# Altium schematic sheet Connector_Exp.SchDoc: Connectors
size A3; Organization: PRISUM; Revision: 2; SheetNumber: 2; SheetTotal: 6
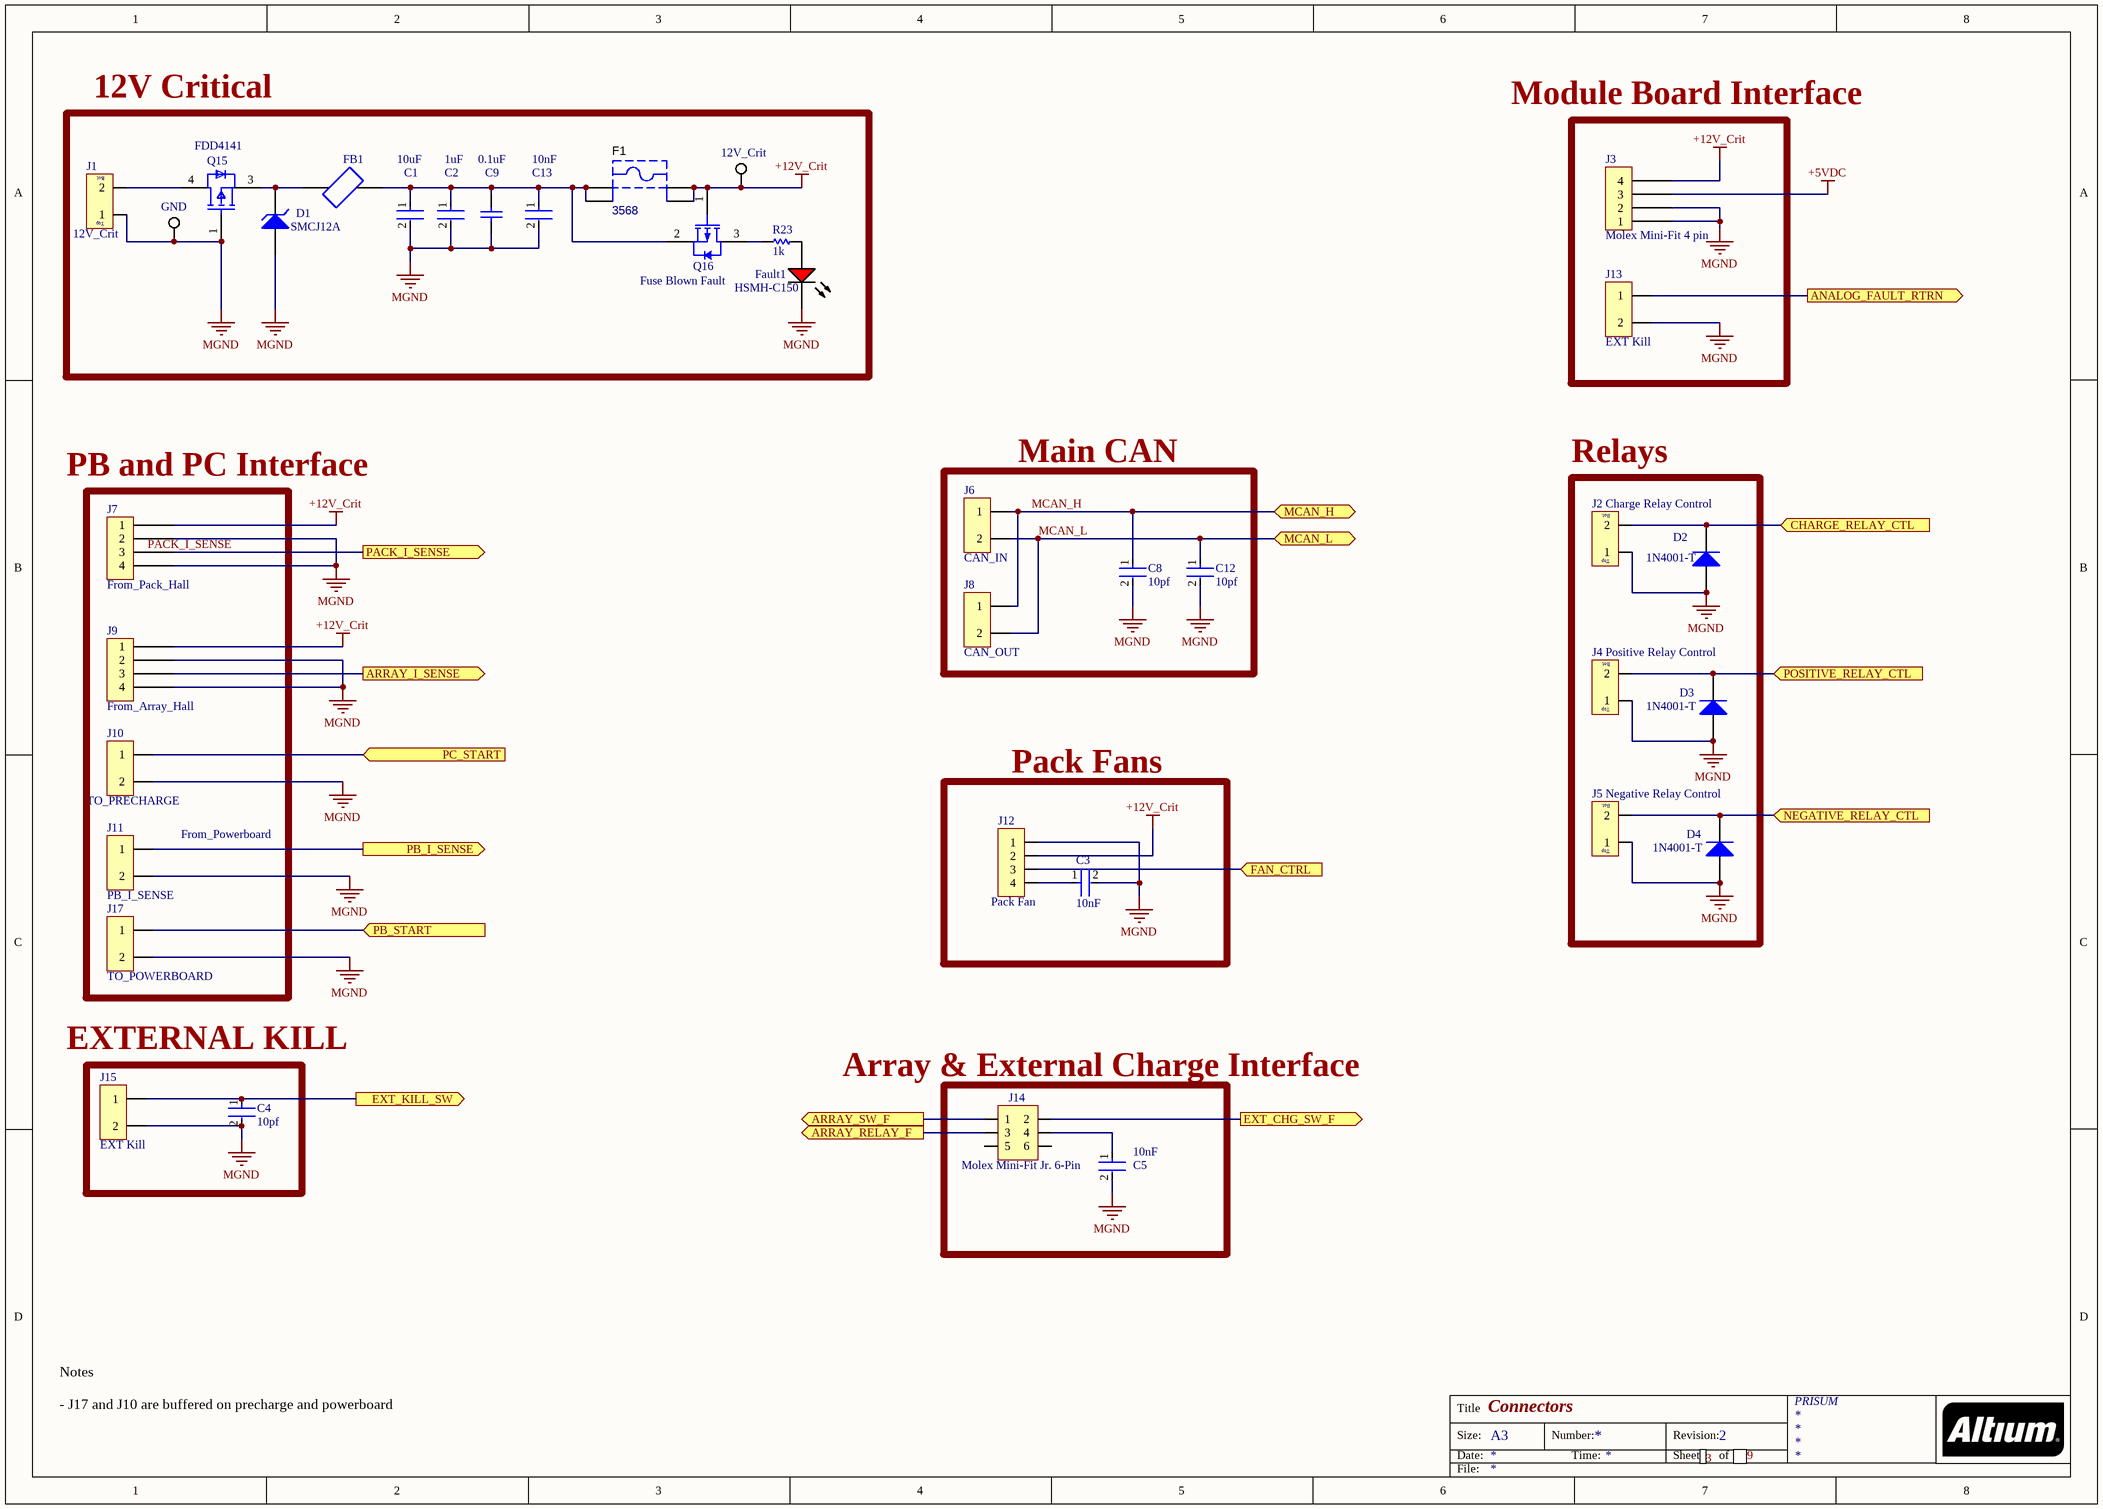
[diagram p0: Connector_Exp.SchDoc]

## Parts
12V_Crit  Test Point  [Test Point]  (value not drawn)
C1  Capacitance: 10uF  [FP-CL31-IPC_A]  (hidden comment: CL31A106MOHNNNE)
C2  Capacitance: 1uF  [FP-CL31-IPC_A]  (hidden comment: CL31F105ZOCNNNC)
C3  Capacitance: 10nF  [FP-CGA3E-0_3-0_1-IPC_A]  (hidden comment: CGA3E2X8R2A103K080AD)
C4  10pf  [FP-C0805C-DN-MFG]
C5  Capacitance: 10nF  [FP-CGA3E-0_3-0_1-IPC_A]  (hidden comment: CGA3E2X8R2A103K080AD)
C8  10pf  [FP-C0805C-DN-MFG]
C9  Capacitance: 0.1uF  [CAPC2013X94X50LL20T25]  (hidden comment: 08055C104JAT2A)
C12  10pf  [FP-C0805C-DN-MFG]
C13  Capacitance: 10nF  [FP-CGA3E-0_3-0_1-IPC_A]  (hidden comment: CGA3E2X8R2A103K080AD)
D1  SMCJ12A  [LFUS-DO-214AB-2_V]
D2  1N4001-T  [DIOD-DO-41-P-2_V]
D3  1N4001-T  [DIOD-DO-41-P-2_V]
D4  1N4001-T  [DIOD-DO-41-P-2_V]
F1  3568  [KSTN-3568_V]
Fault1  HSMH-C150  [AVAG-HSMX-C150_V]
FB1  HI1206N800R-10  [FB_HI1206N800R-10]  (value not drawn)
GND  Test Point  [Test Point]  (value not drawn)
J1  12V_Crit  [CONN_2P_MEGAFIT_HORIZONTAL]
J2  Charge Relay Control  [CONN_2P_MEGAFIT_HORIZONTAL]
J3  Molex Mini-Fit 4 pin  [Molex Mini-Fit Jr. 4-Pin - no flange]
J4  Positive Relay Control  [CONN_2P_MEGAFIT_HORIZONTAL]
J5  Negative Relay Control  [CONN_2P_MEGAFIT_HORIZONTAL]
J6  CAN_IN  [Mini-Fit Jr. 2]
J7  From_Pack_Hall  [Molex Mini-Fit Jr. 4-Pin - no flange]
J8  CAN_OUT  [Mini-Fit Jr. 2]
J9  From_Array_Hall  [Molex Mini-Fit Jr. 4-Pin - no flange]
J10  TO_PRECHARGE  [Mini-Fit Jr. 2]
J11  PB_I_SENSE  [Mini-Fit Jr. 2]
J12  Molex Mini-Fit Jr. 4-Pin no flange  [Molex Mini-Fit Jr. 4-Pin - no flange]  (value not drawn)
J13  EXT Kill  [Mini-Fit Jr. 2]
J14  Molex Mini-Fit Jr. 6-Pin  [Molex Mini-Fit Jr. 6-Pin]
J15  EXT Kill  [Mini-Fit Jr. 2]
J17  TO_POWERBOARD  [Mini-Fit Jr. 2]
Q15  FDD4141  [FP-369AS-MFG]
Q16  Fuse Blown Fault  [INTR-SOT-23-3_V]
R23  SchematicInformation: 1k  [R_0603]  (hidden comment: RES_1k_1%_0603)

## Blocks framed on the sheet
12V Critical: 12V_Crit C1 C2 C9 C13 D1 F1 Fault1 FB1 GND J1 Q15 Q16 R23
From_Powerboard: J7 J9-J11 J17
Main CAN: C8 C12 J6 J8
Relays: D2-D4 J2 J4 J5
Pack Fans: C3 J12

## Ports
ANALOG_FAULT_RTRN (out), ARRAY_I_SENSE (out), ARRAY_RELAY_F (out), ARRAY_SW_F (out), CHARGE_RELAY_CTL (in), EXT_CHG_SW_F (out), EXT_KILL_SW (out), FAN_CTRL (in), MCAN_H (bidir), MCAN_L (bidir), NEGATIVE_RELAY_CTL (in), PACK_I_SENSE (out), PB_I_SENSE (out), PB_START (in), PC_START (in), POSITIVE_RELAY_CTL (in)

## Nets
+5VDC: J3.3
+12V_Crit: 12V_Crit.1 F1.3 F1.4 J3.4 J7.1 J9.1 J12.2 Q16.1(GATE)
MGND: C1.2 C2.2 C3.2 C4.2 C5.2 C8.2 C9.1 C12.2 C13.2 D1.1(A) D2.1(A) D3.1(A) D4.1(A) Fault1.2(K) GND.1 J1.1 J2.1 J3.1 J3.2 J4.1 J5.1 J7.2 J7.4 J9.2 J9.4 J10.2 J11.2 J12.1 J13.2 J15.2 J17.2 Q15.1(G)
ANALOG_FAULT_RTRN: J13.1 ; port ANALOG_FAULT_RTRN
ARRAY_I_SENSE: J9.3 ; port ARRAY_I_SENSE
ARRAY_RELAY_F: J14.3 ; port ARRAY_RELAY_F
ARRAY_SW_F: J14.1 ; port ARRAY_SW_F
CHARGE_RELAY_CTL: D2.2(K) J2.2 ; port CHARGE_RELAY_CTL
EXT_CHG_SW_F: J14.2 ; port EXT_CHG_SW_F
EXT_KILL_SW: C4.1 J15.1 ; port EXT_KILL_SW
FAN_CTRL: J12.3 ; port FAN_CTRL
MCAN_H: C8.1 J6.1 J8.1 ; port MCAN_H
MCAN_L: C12.1 J6.2 J8.2 ; port MCAN_L
NEGATIVE_RELAY_CTL: D4.2(K) J5.2 ; port NEGATIVE_RELAY_CTL
PACK_I_SENSE: J7.3 ; port PACK_I_SENSE
PB_I_SENSE: J11.1 ; port PB_I_SENSE
PB_START: J17.1 ; port PB_START
PC_START: J10.1 ; port PC_START
POSITIVE_RELAY_CTL: D3.2(K) J4.2 ; port POSITIVE_RELAY_CTL
NetC1_1: C1.1 C2.1 C9.2 C13.1 F1.1 F1.2 FB1.2 Q16.2(SOURCE)
NetC3_1: C3.1 J12.4
NetC5_1: C5.1 J14.4
NetD1_2: D1.2(K) FB1.1 Q15.3(S)
NetFault1_1: Fault1.1(A) R23.2
NetJ1_2: J1.2 Q15.4(D)
NetQ16_3: Q16.3(DRAIN) R23.1

Not connected (* = marked no-connect by the designer): J14 5 6

## Notes on the sheet
- Module Board Interface
- (near J7) PB and PC Interface
- (near J12) Pack Fan
- EXTERNAL KILL
- (near J14) Array & External Charge Interface
- Notes
  - J17 and J10 are buffered on precharge and powerboard
- 3
- 9
- Labels drawn without touching a wire or pin: PACK_I_SENSE
- Title
- Size:
- Date:
- A3
- Number:
- Time:
- Revision:
- Sheet
- of
- File:
- (in symbol CONN_2P_MEGAFIT_HORIZONTAL) Bot.; Top

## Library data of the parts
C1 = CMP-13271-002453-1: Cap Ceramic 10uF 16V X5R ±20% SMD 1206 +85°C Embossed T/R; Thickness: 0.071inch; Case Code (Imperial): 1206; Case Code (Metric): 3216; Height: 1.6mm; Max Operating Temperature: 85°C; Voltage Rating: 16V; Package Quantity: 1; Length: 3.2mm; Dielectric: X5R; Voltage Rating (DC): 16V; Tolerance: 20%; Case/Package: 1206; Depth: 1.6mm; Mount: Surface Mount; Radiation Hardening: No; Width: 0.063inch; Lead Free: Lead Free; Min Operating Temperature: -55°C; Packaging: Tape and Reel
C2 = CMP-13271-003959-1: Cap Ceramic 1uF 16V Y5V -20/+80% SMD 1206 +85°C Embossed T/R; Tolerance: 80%; Length: 3.2mm; Package Quantity: 4000; Lead Free: Lead Free; Height: 0.85mm; Packaging: Tape and Reel; Max Operating Temperature: 85°C; Case Code (Imperial): 1206; Case/Package: 1206; Dielectric: Y5V; Min Operating Temperature: -30°C; Voltage Rating (DC): 16V; Width: 0.063inch; Mount: Surface Mount; Voltage Rating: 16V; Depth: 1.6mm; Thickness: 0.039inch; Radiation Hardening: No; Case Code (Metric): 3216
C3 C5 C13 = CMP-08246-000769-1: Cap Ceramic 10nF 100V X8R 10% Pad SMD 0603 +150°C Automotive T/R; Mount: Surface Mount; Voltage Rating (DC): 100V; Termination: SMD/SMT; Dielectric: X8R; Case/Package: 0603; Ratings: AEC-Q200; Voltage Rating: 100V; Packaging: Tape and Reel; Thickness: 0.035inch; Composition: Ceramic; Max Operating Temperature: 150°C; Width: 0.031inch; Height: 0.8mm; Weight: 7.1E-05oz; Depth: 0.8mm; Min Operating Temperature: -55°C; Length: 1.6mm; Case Code (Metric): 1608; Tolerance: 10%; Package Quantity: 4000; Case Code (Imperial): 0603
C4 C8 C12 = CMP-03020-001866-1: C0805 10 pF C0G 30ppm/°C 2.00% 50 V; Manufacturer Part Number: C0805C100G5GACTU; Manufacturer: KEMET; Tolerance: 0.02; Voltage Rating: 50 V; Material: Ceramic; Device Class L1: Passive Components; Category: Cap; Temperature: -55°C to +125°C; Height: 0.88mm; Ipc Land Pattern Name: CAPC200125X78; ComponentLink2URL: https://content.kemet.com/datasheets/KEM_C1003_C0G_SMD.pdf; Capacitance: 10 pF; Octopart: https://octopart.com/c0805c100g5gactu-kemet-20071675; Device Class L2: Capacitors; Device Class L3: Ceramic Capacitors; Temperature Range Low: -55°C; RoHS: TRUE; Temperature Range High: +125°C; Temperature Characteristic: C0G; Value: 10 pF; Mouser Description: Multilayer Ceramic Capacitors MLCC - SMD/SMT 50volts 10pF C0G 2%; ComponentLink2Description: Datasheet; Package: C0805C-DN; Lead Free: Yes; Automotive: No; Temperature Coefficient: 30ppm/°C
C9 = CMP-2000-05808-1: Chip Capacitor, 0.1 uF, +/- 5%, 50 V, -55 to 125 degC, 0805 (2012 Metric), RoHS, Tape and Reel; Case Width: 1.25mm; Case Length: 2.01mm; Case Height: 0.94mm; Brand: AVX; Type: StandardX7RMLCCs; Capacitance - nF: 100nF; Dissipation Factor DF: 2.5; Voltage Rating DC: 50V; Temperature Coefficient / Code: +/-15%; Capacitance - pF: 100000pF; Dielectric: X7R; Dimensions: 1.25mmWx2.01mmLx0.94mmH; Product: GeneralTypeMLCCs; Package Description: 2-Pin Surface Mount Device, Body 2.01 x 1.25 mm; Package / Case: 0805(2012metric); Product Category: MultilayerCeramicCapacitorsMLCC-SMD/SMT; Case Code - mm: 2012; Packaging: Reel; Manufacturer URL: http://www.avx.com/; Operating Temperature Range: -55Cto+125C; Termination Style: SMD/SMT; Maximum Operating Temperature: +125C; Case Code - in: 0805; Minimum Operating Temperature: -55C; Factory Pack Quantity: 4000; RoHS: Details; Voltage Rating: 50V; Tolerance: 5%; Package Reference: 0805; Datasheet URL: http://www.farnell.com/datasheets/1679506.pdf; Manufacturer: AVX; Mounting Technology: SurfaceMount; Datasheet Version: 11/2012
D1 = CMP-2000-07101-1: Transient Voltage Suppression Diode, 12 V, -65 to 150 degC, 2-Pin DO-214AB (SMCJ), RoHS, Tape and Reel; Manufacturer: Littelfuse; Directional: Uni-Directional; Breakdown Voltage-Max: 14.7V; Clamping Voltage-Max: 19.9V; Breakdown Voltage-Min: 13.3V; Power Dissipation: 1500W; Manufacturer URL: http://www.littelfuse.com/; Datasheet Version: 11/2015; Package Description: 2-Pin Surface Mount Device, Body 6.855 x 5.905 mm; Package Reference: DO-214AB; Mounting Technology: SurfaceMount; Datasheet URL: http://www.littelfuse.com/products/tvs-diodes/surface-mount/~/media/electronics/datasheets/tvs_diodes/littelfuse_tvs_diode_smcj_datasheet.pdf.pdf; ComponentLink1Description: Datasheet; ComponentLink1URL: https://www.littelfuse.com/products/tvs-diodes/surface-mount/~/media/electronics/datasheets/tvs_diodes/littelfuse_tvs_diode_smcj_datasheet.pdf.pdf; ComponentLink2Description: Digikey; ComponentLink2URL: https://www.digikey.com/product-detail/en/SMCJ12A/SMCJ12ALFCT-ND/762588?utm_campaign=buynow&WT.z_cid=ref_octopart_dkc_buynow&utm_medium=aggregator&curr=usd&site=us&utm_source=octopart
D2-D4 = CMP-0639-00006-2: 1.0 A Rectifier, 15 pF, 50 V, -65 to 150 degC, 2-Pin DO-41 Plastic, RoHS, Tape and Reel; Manufacturer: Diodes Inc; VF (V): 1; CT (pF): 15; Max. IR (uA): 5; VRRM (V): 50; Max. IFSM (A): 30; RoHS: TRUE; Mounting Technology: Through Hole; PartNumber: 1N4001-T; ComponentLink2Description: Datasheet; DatasheetVersion: Rev. 8-2; Operating Temperature Range (degC): -65 to 150; Packing: Tape and Reel; PackageReference: DO-41-P-2; ComponentLink1URL: http://diodes.com/; PackageDescription: 2-Pin Axial Lead, Body 4.635 x 2.36 mm, Lead Spread 25.4 mm; ComponentLink2URL: http://diodes.com/datasheets/ds28002.pdf; Max. Average Rectified Current IO (A): 1; ComponentLink1Description: Manufacturer URL
F1 = CMP-2000-05464-1: Fuse Holder, 20 A, 500 V, -50 to 145 degC, 4-Pin THD, RoHS; Manufacturer: Keystone; Package Reference: 3568; Datasheet Version: 04/2013; Datasheet URL: https://datasheet.ciiva.com/16294/m60-2p40-16294706.pdf; Manufacturer URL: http://www.keyelco.com/; Mounting Technology: ThroughHole; Package Description: 4-Pin Through Hole Device, Body 16 x 6.73 mm, Pitch 9.9 mm
Fault1 = CMP-2000-06426-1: LED Uni-Color Red, 65 mW, 25 mA, -40 to 85 degC, 2-Pin SMD, RoHS, Tape and Reel; Manufacturer: Avago; Product Height (mm): 1.1mm; Power Dissipation: 78W; Product Length (mm): 3.2mm; Forward Voltage: 2.6V; Luminous Intensity: 17mcd; DELETED: Compliant; Shape Type: Rectangular; Peak Wavelength: 660nm; Main Category: ChipLED; Dominant Wave Length: 639nm; Rad Hardened: No; Lens Type: ColorlessDiffused; Product Depth (mm): 1.6mm; Reverse Voltage: 5V; Forward Current: 25mA; Chip Material: GaAlAs; Test Current (It): 20mA; Viewing Angle: 170deg; Number of  Elements: 1; Type: Uni-Color; Package Reference: HSMX-C150; Package Description: 2-Pin Surface Mount Device, Body 3.2 x 1.6 mm; Operating Temp Range: -40Cto85C; Mounting: SurfaceMount; Emitting Color: Red; Pin Count: 2; Operating Temperature Classification: Industrial; Datasheet URL: http://media.digikey.com/pdf/Data%20Sheets/Avago%20PDFs/HSMz-Czzz.pdf; Package Type: ChipLed; Mounting Technology: SurfaceMount; High Brightness: No; Lens Dimensions: 2x1.6x0.6mm; Manufacturer URL: http://www.avagotech.com/; Lum Intensity: 17mcd; Datasheet Version: 03/2012; Packaging: TapeandReel
FB1 = HI1206N800R-10: 80 Ohms @ 100MHz 1 Power, Signal Line Ferrite Bead 1206 (3216 Metric) 3A 35mOhm; MF: Laird-Signal Integrity; SnapEDA_Link: https://www.snapeda.com/parts/HI1206N800R-10/Laird-Signal%20Integrity%20Products/view-part/296889/?ref=snap; Purchase-URL: https://pricing.snapeda.com/search/part/HI1206N800R-10/?ref=eda; Check_prices: https://www.snapeda.com/parts/HI1206N800R-10/Laird-Signal%20Integrity%20Products/view-part/296889/?ref=eda; Value: *; Digi-Key_Part_Number: 240-2409-1-ND; Package: 1206 Laird-Signal Integrity; MP: HI1206N800R-10
J1 J2 J4 J5 = CONN_2P_MEGAFIT_HORIZONTAL: *; Manufacturer Part Number: 0768250002; Manufacturer: Molex; SchematicInformation: MegaFit_2P; DigiKey Part Number: WM11969-ND
J6 J8 J10 J11 J13 J15 J17 = Mini-Fit Jr. 2-pin: Mini-Fit Jr. 2-pin Right Angle; Manufacturer: Molex Inc; Manufacturer Part Number: 0039300020; Connector Type: Header, Shrouded; Number of Positions: 2; Number of Positions Loaded: All; Row Spacing: 0.165" (4.20mm); Ordering: http://search.digikey.com/scripts/DkSearch/dksus.dll?Detail&name=WM1351-ND; Datasheet: http://www.molex.com/pdm_docs/sd/039301020_sd.pdf; Supplier 1: Digi-Key; RoHS: RoHS Compliant; Category: Connectors, Interconnects; Stock 1: 371; Pricing 1: 1=0.77, 10=0.674, 50=0.6078, 100=0.5815, 250=0.5286, 500=0.47574, 1000=0.42288, 2500=0.38324, 5000=0.37002 (USD); Contact Type: Male Pin; Pitch: -; Number of Rows: 2; Contact Mating Length: -; Mounting Type: Through Hole, Right Angle; Termination: Solder; Fastening Type: Locking Ramp; Features: Board Lock; Contact Finish: Tin; Contact Finish Thickness: 200µin (5.08µm); Color: Natural; Packaging: Tray; ComponentLink1URL: http://www.molex.com/pdm_docs/sd/039300020_sd.pdf; ComponentLink1Description: http://www.molex.com/pdm_docs/sd/039300020_sd.pdf
  J6 J8 J11 J13 J15 J17: Supplier Part Number 1: WM21351-ND
J7 J9 = Molex Mini-Fit 4 pin
J12 = Molex Mini-Fit Jr. 4-Pin: 4-Pin Molex Mini-Fit Jr. Header; Manufacturer Part Number: 0039301040; Connector Type: Header, Shrouded; Number of Positions: 4; Number of Positions Loaded: All; Pitch: 0.165" (4.20mm); Drawn By: Aaron Mills; Drawing Date: Jan. 2, 2011; Manufacturer: Molex; ComponentLink1URL: http://www.molex.com/pdm_docs/sd/039295043_sd.pdf; ComponentLink1Description: Datasheet; Supplier1: http://search.digikey.com/us/en/products/39-30-1040/WM1352-ND/561079; Supplier 1: Digi-Key; RoHS: RoHS Compliant; Category: Connectors, Interconnects; Stock 1: 4191; Pricing 1: 1=0.77, 10=0.674, 25=0.6344, 50=0.6078, 100=0.5815, 250=0.5286, 500=0.47574, 1000=0.42288, 2500=0.38324 (USD); Contact Type: Male Pin; Number of Rows: 2; Row Spacing: 0.165" (4.20mm); Contact Mating Length: -; Mounting Type: Through Hole, Right Angle; Termination: Solder; Fastening Type: Locking Ramp; Features: Board Lock; Contact Finish: Tin; Contact Finish Thickness: 100µin (2.54µm); Color: Natural; Packaging: Tray; ComponentLink2URL: http://www.molex.com/pdm_docs/sd/039301040_sd.pdf; ComponentLink2Description: http://www.molex.com/pdm_docs/sd/039301040_sd.pdf; Supplier Part Number 1: WM1352-ND
J14 = Molex Mini-Fit Jr. 6-Pin: 6-Pin Molex Mini-Fit Jr. Header  through hole; Drawn By: Aaron Mills; Drawing Date: Jan. 2, 2011; Manufacturer: Molex; ComponentLink1URL: http://www.molex.com/pdm_docs/sd/039295063_sd.pdf; ComponentLink1Description: Datasheet; ComponentLink2Description: Mechanical Drawing; Supplier 1: http://search.digikey.com/scripts/DkSearch/dksus.dll?Detail&name=WM3922-ND
Q15 = CMP-07173-000088-1: MOSFET P-CH 40V 10.8A DPAK; Manufacturer: ON Semiconductor; Gate Charge At Vgs: 36nC @ -10V; Transconductance: 38S; Drain To Source Breakdown Voltage: -40V; Reverse Recovery Time: 29ns; Pulse Drain Current: -100A; Reverse Recovery Charge: 26nC; Drain To Source Resistance: 10.1mΩ; Power Dissipation: 2.4W; Max Forward Diode Voltage: -1.2V; Turn Off Delay Time: 38ns; Number Of P Channels: 1; Gate To Source Voltage: 20V; Rthja Max: 52°C/W; Depletion Mode: False; Threshold Vgs Max: -3V; Threshold Vgs Min: -1V; Turn On Delay Time: 10ns; Max Junction Temp: +150°C; Input Capacitace At Vds: 2085pF @ -20V; Continuous Drain Current: -10.8A; Typ Forward Diode Voltage: -0.8V; Package: 369AS; Category: Diode; RoHS: TRUE; Device Class L2: Transistors; Octopart: https://octopart.com/fdd4141-on+semiconductor-84325802; Temperature: -55°C to +150°C; Drain To Source Voltage: -40V; Device Class L1: Discrete Semiconductors; Temperature Range Low: -55°C; Height: 2.517mm; ComponentLink2Description: Datasheet; Automotive: No; Number Of Channels: 1; Digikey Description: MOSFET P-CH 40V 10.8A DPAK; Lead Free: Yes; Manufacturer Part Number: FDD4141; Temperature Range High: +150°C; Footprint Url: https://www.onsemi.com/pub/Collateral/369AS.PDF; Device Class L3: MOSFETs; Mouser Description: MOSFET -40V P-Channel PowerTrench; ComponentLink2URL: https://www.onsemi.com/pub/Collateral/FDD4141-D.pdf
Q16 = CMP-2000-04987-1: HEXFET(R) Power P-Channel MOSFET, -20 V, -3.7 A, -55 to 150 degC, 3-Pin SOT-23, RoHS, Tape and Reel; Manufacturer: International Rectifier; Drain-to-Source Voltage [Vdss]: 20V; Rated Power Dissipation: 1.3W; Qg Gate Charge: 8nC; Drain-Source On Resistance-Max: 0.065O; Channel Type: P-Channel; Package Reference: SOT-23-3; Manufacturer URL: http://internationalrectifier.com/; Datasheet URL: http://datasheet.octopart.com/IRLML6402TRPBF-International-Rectifier-datasheet-93882.pdf; Datasheet Version: Feb-05; Package Description: 3-Pin Small Outline Transistor, Body 2.92 x 1.3 mm, Pitch 0.95 mm
R23 = RES_1k_1%_0603: Manufacturer Part Number: RC0603FR-071KL; Manufacturer: Yageo; DigiKey Part Number: 311-1.00KHRCT-ND